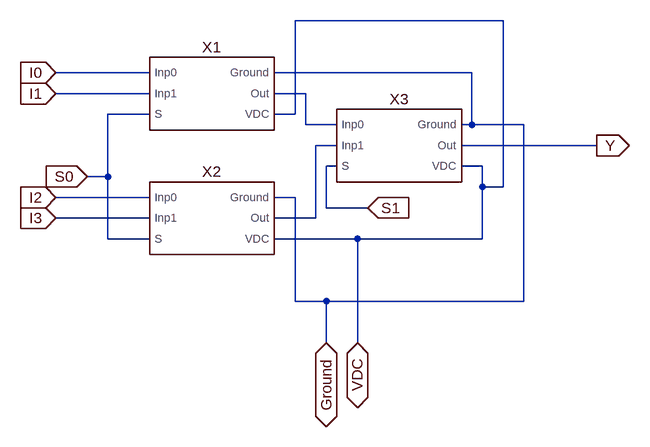
[diagram p0: schematic 4X1_MUX.asc]
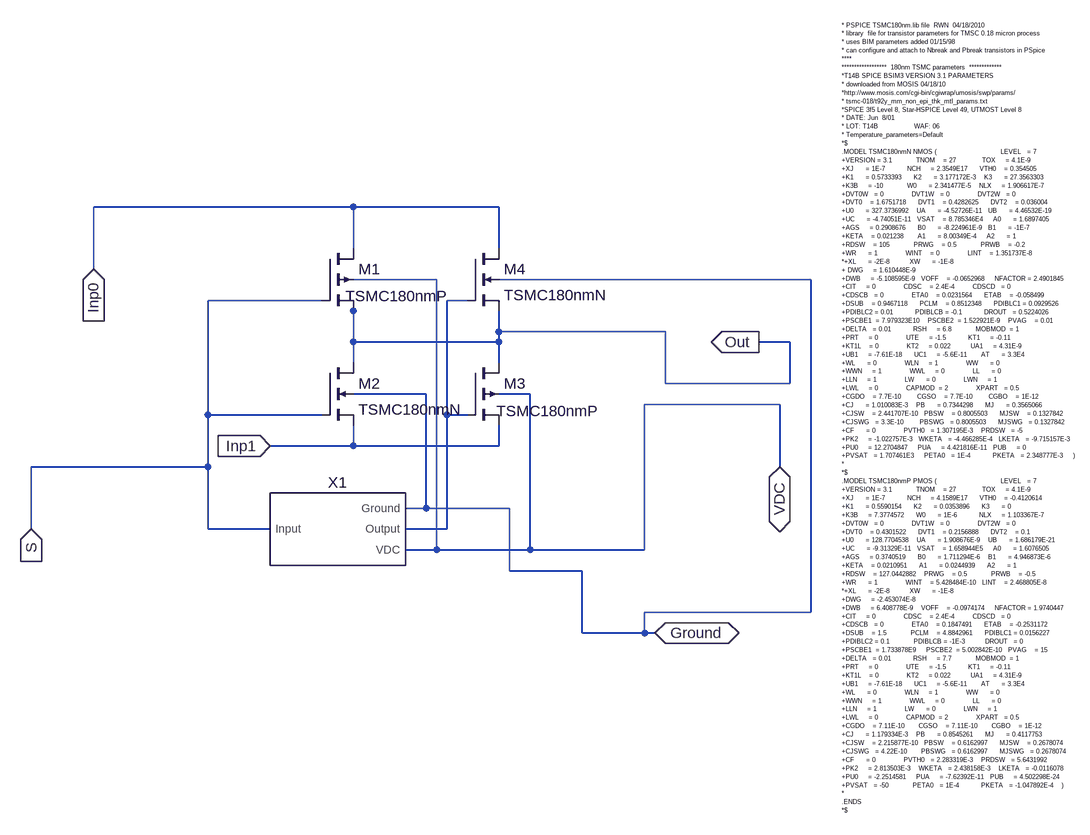
[diagram p1: sub-circuit 2x1_mux.asc]
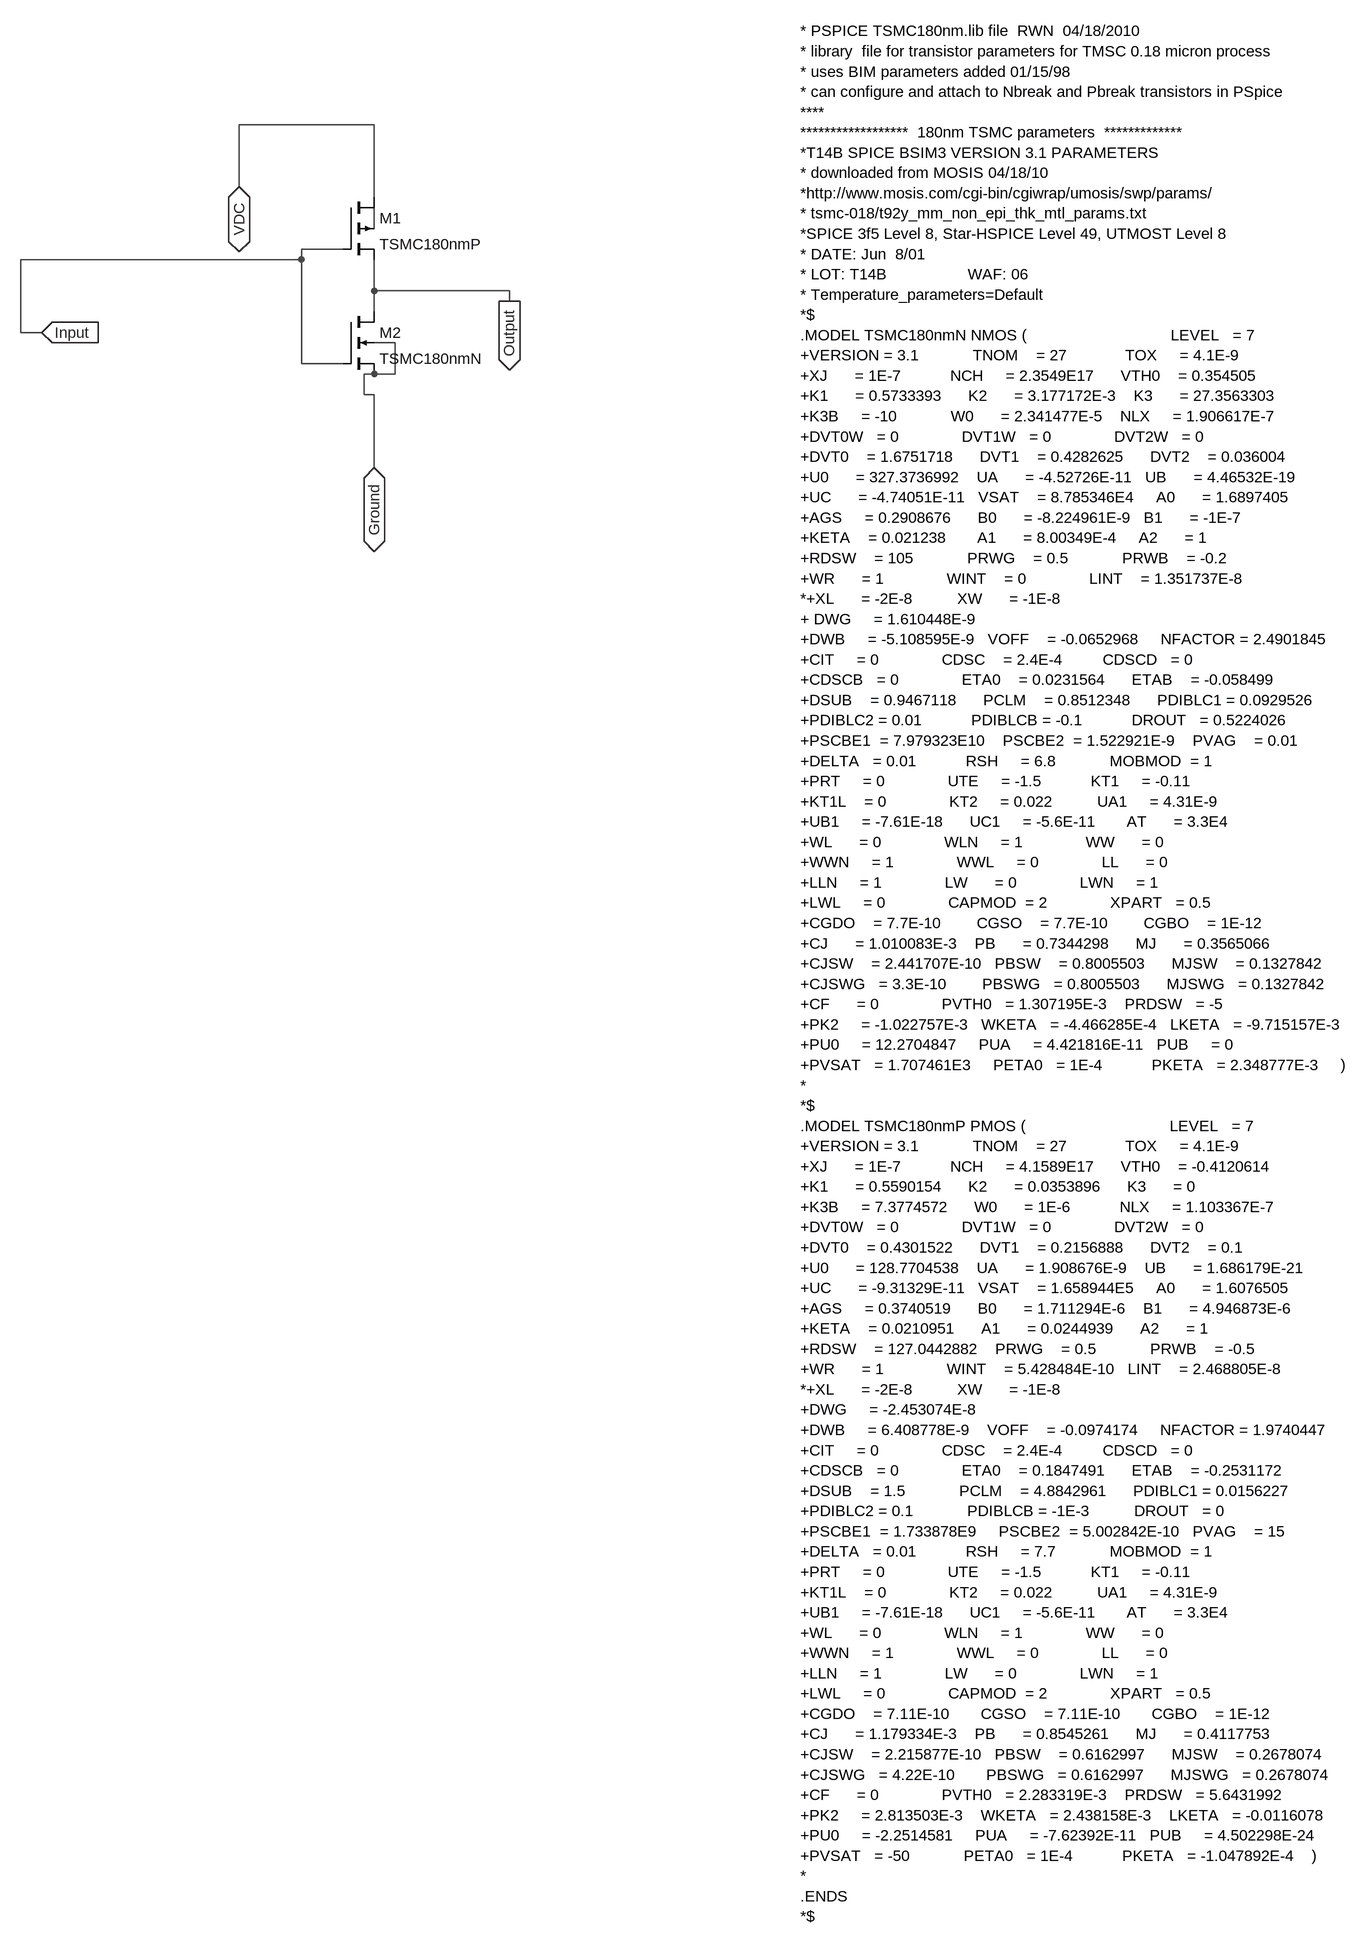
[diagram p2: sub-circuit not_gate.asc]
4X1_MUX.asc, the LTspice schematic file:
Version 4
SHEET 1 880 704
WIRE 656 64 336 64
WIRE 112 144 -32 144
WIRE 608 144 304 144
WIRE 112 176 -32 176
WIRE 352 176 304 176
WIRE 112 208 48 208
WIRE 336 208 336 64
WIRE 336 208 304 208
WIRE 352 224 352 176
WIRE 400 224 352 224
WIRE 608 224 608 144
WIRE 608 224 592 224
WIRE 688 224 608 224
WIRE 400 256 368 256
WIRE 800 256 592 256
WIRE 400 288 384 288
WIRE 624 288 592 288
WIRE 48 304 48 208
WIRE 48 304 16 304
WIRE 624 320 624 288
WIRE 656 320 656 64
WIRE 656 320 624 320
WIRE 112 336 -32 336
WIRE 336 336 304 336
WIRE 384 352 384 288
WIRE 448 352 384 352
WIRE 112 368 -32 368
WIRE 368 368 368 256
WIRE 368 368 304 368
WIRE 48 400 48 304
WIRE 112 400 48 400
WIRE 432 400 304 400
WIRE 624 400 624 320
WIRE 624 400 432 400
WIRE 336 496 336 336
WIRE 384 496 336 496
WIRE 688 496 688 224
WIRE 688 496 384 496
WIRE 384 560 384 496
WIRE 432 560 432 400
FLAG -32 144 I0
IOPIN -32 144 In
FLAG -32 176 I1
IOPIN -32 176 In
FLAG -32 336 I2
IOPIN -32 336 In
FLAG -32 368 I3
IOPIN -32 368 In
FLAG 16 304 S0
IOPIN 16 304 In
FLAG 448 352 S1
IOPIN 448 352 In
FLAG 432 560 VDC
IOPIN 432 560 BiDir
FLAG 384 560 Ground
IOPIN 384 560 BiDir
FLAG 800 256 Y
IOPIN 800 256 Out
SYMBOL 2X1_MUX 208 176 R0
SYMATTR InstName X1
SYMBOL 2X1_MUX 208 368 R0
SYMATTR InstName X2
SYMBOL 2X1_MUX 496 256 R0
SYMATTR InstName X3

2x1_mux.asc, the sub-circuit schematic file:
Version 4
SHEET 1 936 680
WIRE -192 -224 -592 -224
WIRE 32 -224 -192 -224
WIRE -192 -160 -192 -224
WIRE 32 -160 32 -224
WIRE -592 -128 -592 -224
WIRE -64 -112 -192 -112
WIRE 512 -112 32 -112
WIRE -240 -80 -416 -80
WIRE -16 -80 -48 -80
WIRE -192 -64 -192 -80
WIRE 32 -32 32 -64
WIRE 288 -32 32 -32
WIRE -192 -16 -192 -64
WIRE 32 -16 32 -32
WIRE 32 -16 -192 -16
WIRE 480 -16 432 -16
WIRE -192 16 -192 -16
WIRE 32 16 32 -16
WIRE 288 48 288 -32
WIRE 480 48 480 -16
WIRE 480 48 288 48
WIRE -80 64 -192 64
WIRE 80 64 32 64
WIRE 464 80 256 80
WIRE -416 96 -416 -80
WIRE -240 96 -416 96
WIRE -48 96 -48 -80
WIRE -16 96 -48 96
WIRE -192 144 -192 112
WIRE -192 144 -320 144
WIRE 32 144 32 112
WIRE 32 144 -192 144
WIRE -416 176 -416 96
WIRE -416 176 -688 176
WIRE 464 176 464 80
WIRE -80 240 -80 64
WIRE -80 240 -112 240
WIRE 48 240 -80 240
WIRE -688 272 -688 176
WIRE -416 272 -416 176
WIRE -320 272 -416 272
WIRE -48 272 -48 96
WIRE -48 272 -112 272
WIRE -64 304 -64 -112
WIRE -64 304 -112 304
WIRE 80 304 80 64
WIRE 80 304 -64 304
WIRE 256 304 256 80
WIRE 256 304 80 304
WIRE 48 336 48 240
WIRE 160 336 48 336
WIRE 512 400 512 -112
WIRE 512 400 256 400
WIRE 160 432 160 336
WIRE 256 432 256 400
WIRE 256 432 160 432
WIRE 272 432 256 432
FLAG -592 -128 Inp0
IOPIN -592 -128 In
FLAG -320 144 Inp1
IOPIN -320 144 In
FLAG -688 272 S
IOPIN -688 272 In
FLAG 464 176 VDC
IOPIN 464 176 BiDir
FLAG 272 432 Ground
IOPIN 272 432 BiDir
FLAG 432 -16 Out
IOPIN 432 -16 Out
SYMBOL pmos4 -240 -160 R0
WINDOW 3 36 73 Left 2
SYMATTR Value TSMC180nmP
SYMATTR InstName M1
SYMATTR Value2 l=180n w=720n
SYMBOL nmos4 -240 16 R0
SYMATTR InstName M2
SYMATTR Value TSMC180nmN
SYMATTR Value2 l=180n w=360n
SYMBOL pmos4 -16 16 R0
WINDOW 3 44 74 Left 2
SYMATTR Value TSMC180nmP
SYMATTR InstName M3
SYMATTR Value2 l=180n w=720n
SYMBOL nmos4 -16 -160 R0
SYMATTR InstName M4
SYMATTR Value TSMC180nmN
SYMATTR Value2 l=180n w=360n
SYMBOL NOT_Gate -224 272 R0
SYMATTR InstName X1
TEXT 560 -504 Left 0 !* PSPICE TSMC180nm.lib file  RWN  04/18/2010\n* library  file for transistor parameters for TMSC 0.18 micron process\n* uses BIM parameters added 01/15/98\n* can configure and attach to Nbreak and Pbreak transistors in PSpice\n****\n******************  180nm TSMC parameters  *************\n*T14B SPICE BSIM3 VERSION 3.1 PARAMETERS\n* downloaded from MOSIS 04/18/10\n*http://www.mosis.com/cgi-bin/cgiwrap/umosis/swp/params/\n* tsmc-018/t92y_mm_non_epi_thk_mtl_params.txt\n*SPICE 3f5 Level 8, Star-HSPICE Level 49, UTMOST Level 8\n* DATE: Jun  8/01\n* LOT: T14B                  WAF: 06\n* Temperature_parameters=Default\n*$\n.MODEL TSMC180nmN NMOS (                                LEVEL   = 7\n+VERSION = 3.1            TNOM    = 27             TOX     = 4.1E-9\n+XJ      = 1E-7           NCH     = 2.3549E17      VTH0    = 0.354505\n+K1      = 0.5733393      K2      = 3.177172E-3    K3      = 27.3563303\n+K3B     = -10            W0      = 2.341477E-5    NLX     = 1.906617E-7\n+DVT0W   = 0              DVT1W   = 0              DVT2W   = 0\n+DVT0    = 1.6751718      DVT1    = 0.4282625      DVT2    = 0.036004\n+U0      = 327.3736992    UA      = -4.52726E-11   UB      = 4.46532E-19\n+UC      = -4.74051E-11   VSAT    = 8.785346E4     A0      = 1.6897405\n+AGS     = 0.2908676      B0      = -8.224961E-9   B1      = -1E-7\n+KETA    = 0.021238       A1      = 8.00349E-4     A2      = 1\n+RDSW    = 105            PRWG    = 0.5            PRWB    = -0.2\n+WR      = 1              WINT    = 0              LINT    = 1.351737E-8\n*+XL      = -2E-8          XW      = -1E-8         \n+ DWG     = 1.610448E-9\n+DWB     = -5.108595E-9   VOFF    = -0.0652968     NFACTOR = 2.4901845\n+CIT     = 0              CDSC    = 2.4E-4         CDSCD   = 0\n+CDSCB   = 0              ETA0    = 0.0231564      ETAB    = -0.058499\n+DSUB    = 0.9467118      PCLM    = 0.8512348      PDIBLC1 = 0.0929526\n+PDIBLC2 = 0.01           PDIBLCB = -0.1           DROUT   = 0.5224026\n+PSCBE1  = 7.979323E10    PSCBE2  = 1.522921E-9    PVAG    = 0.01\n+DELTA   = 0.01           RSH     = 6.8            MOBMOD  = 1\n+PRT     = 0              UTE     = -1.5           KT1     = -0.11\n+KT1L    = 0              KT2     = 0.022          UA1     = 4.31E-9\n+UB1     = -7.61E-18      UC1     = -5.6E-11       AT      = 3.3E4\n+WL      = 0              WLN     = 1              WW      = 0\n+WWN     = 1              WWL     = 0              LL      = 0\n+LLN     = 1              LW      = 0              LWN     = 1\n+LWL     = 0              CAPMOD  = 2              XPART   = 0.5\n+CGDO    = 7.7E-10        CGSO    = 7.7E-10        CGBO    = 1E-12\n+CJ      = 1.010083E-3    PB      = 0.7344298      MJ      = 0.3565066\n+CJSW    = 2.441707E-10   PBSW    = 0.8005503      MJSW    = 0.1327842\n+CJSWG   = 3.3E-10        PBSWG   = 0.8005503      MJSWG   = 0.1327842\n+CF      = 0              PVTH0   = 1.307195E-3    PRDSW   = -5\n+PK2     = -1.022757E-3   WKETA   = -4.466285E-4   LKETA   = -9.715157E-3\n+PU0     = 12.2704847     PUA     = 4.421816E-11   PUB     = 0\n+PVSAT   = 1.707461E3     PETA0   = 1E-4           PKETA   = 2.348777E-3     )\n*\n*$\n.MODEL TSMC180nmP PMOS (                                LEVEL   = 7\n+VERSION = 3.1            TNOM    = 27             TOX     = 4.1E-9\n+XJ      = 1E-7           NCH     = 4.1589E17      VTH0    = -0.4120614\n+K1      = 0.5590154      K2      = 0.0353896      K3      = 0\n+K3B     = 7.3774572      W0      = 1E-6           NLX     = 1.103367E-7\n+DVT0W   = 0              DVT1W   = 0              DVT2W   = 0\n+DVT0    = 0.4301522      DVT1    = 0.2156888      DVT2    = 0.1\n+U0      = 128.7704538    UA      = 1.908676E-9    UB      = 1.686179E-21\n+UC      = -9.31329E-11   VSAT    = 1.658944E5     A0      = 1.6076505\n+AGS     = 0.3740519      B0      = 1.711294E-6    B1      = 4.946873E-6\n+KETA    = 0.0210951      A1      = 0.0244939      A2      = 1\n+RDSW    = 127.0442882    PRWG    = 0.5            PRWB    = -0.5\n+WR      = 1              WINT    = 5.428484E-10   LINT    = 2.468805E-8\n*+XL      = -2E-8          XW      = -1E-8          \n+DWG     = -2.453074E-8\n+DWB     = 6.408778E-9    VOFF    = -0.0974174     NFACTOR = 1.9740447\n+CIT     = 0              CDSC    = 2.4E-4         CDSCD   = 0\n+CDSCB   = 0              ETA0    = 0.1847491      ETAB    = -0.2531172\n+DSUB    = 1.5            PCLM    = 4.8842961      PDIBLC1 = 0.0156227\n+PDIBLC2 = 0.1            PDIBLCB = -1E-3          DROUT   = 0\n+PSCBE1  = 1.733878E9     PSCBE2  = 5.002842E-10   PVAG    = 15\n+DELTA   = 0.01           RSH     = 7.7            MOBMOD  = 1\n+PRT     = 0              UTE     = -1.5           KT1     = -0.11\n+KT1L    = 0              KT2     = 0.022          UA1     = 4.31E-9\n+UB1     = -7.61E-18      UC1     = -5.6E-11       AT      = 3.3E4\n+WL      = 0              WLN     = 1              WW      = 0\n+WWN     = 1              WWL     = 0              LL      = 0\n+LLN     = 1              LW      = 0              LWN     = 1\n+LWL     = 0              CAPMOD  = 2              XPART   = 0.5\n+CGDO    = 7.11E-10       CGSO    = 7.11E-10       CGBO    = 1E-12\n+CJ      = 1.179334E-3    PB      = 0.8545261      MJ      = 0.4117753\n+CJSW    = 2.215877E-10   PBSW    = 0.6162997      MJSW    = 0.2678074\n+CJSWG   = 4.22E-10       PBSWG   = 0.6162997      MJSWG   = 0.2678074\n+CF      = 0              PVTH0   = 2.283319E-3    PRDSW   = 5.6431992\n+PK2     = 2.813503E-3    WKETA   = 2.438158E-3    LKETA   = -0.0116078\n+PU0     = -2.2514581     PUA     = -7.62392E-11   PUB     = 4.502298E-24\n+PVSAT   = -50            PETA0   = 1E-4           PKETA   = -1.047892E-4    )\n*\n.ENDS    \n*$

not_gate.asc, the sub-circuit schematic file:
Version 4
SHEET 1 1352 1468
WIRE 320 -128 112 -128
WIRE 112 -32 112 -128
WIRE 320 -16 320 -128
WIRE 320 32 320 0
WIRE 272 64 208 64
WIRE 208 80 208 64
WIRE 208 80 -224 80
WIRE 320 128 320 80
WIRE 528 128 320 128
WIRE 528 144 528 128
WIRE 320 160 320 128
WIRE -224 192 -224 80
WIRE -192 192 -224 192
WIRE 352 208 320 208
WIRE 208 240 208 80
WIRE 272 240 208 240
WIRE 320 256 304 256
WIRE 352 256 352 208
WIRE 352 256 320 256
WIRE 304 288 304 256
WIRE 320 288 304 288
WIRE 320 400 320 288
FLAG 112 -32 VDC
IOPIN 112 -32 BiDir
FLAG 320 400 Ground
IOPIN 320 400 BiDir
FLAG -192 192 Input
IOPIN -192 192 In
FLAG 528 144 Output
IOPIN 528 144 Out
SYMBOL pmos4 272 -16 R0
SYMATTR InstName M1
SYMATTR Value TSMC180nmP
SYMATTR Value2 l=180n w=720n
SYMBOL nmos4 272 160 R0
SYMATTR InstName M2
SYMATTR Value TSMC180nmN
SYMATTR Value2 l=180n w=360n
TEXT 976 -272 Left 0 !* PSPICE TSMC180nm.lib file  RWN  04/18/2010\n* library  file for transistor parameters for TMSC 0.18 micron process\n* uses BIM parameters added 01/15/98\n* can configure and attach to Nbreak and Pbreak transistors in PSpice\n****\n******************  180nm TSMC parameters  *************\n*T14B SPICE BSIM3 VERSION 3.1 PARAMETERS\n* downloaded from MOSIS 04/18/10\n*http://www.mosis.com/cgi-bin/cgiwrap/umosis/swp/params/\n* tsmc-018/t92y_mm_non_epi_thk_mtl_params.txt\n*SPICE 3f5 Level 8, Star-HSPICE Level 49, UTMOST Level 8\n* DATE: Jun  8/01\n* LOT: T14B                  WAF: 06\n* Temperature_parameters=Default\n*$\n.MODEL TSMC180nmN NMOS (                                LEVEL   = 7\n+VERSION = 3.1            TNOM    = 27             TOX     = 4.1E-9\n+XJ      = 1E-7           NCH     = 2.3549E17      VTH0    = 0.354505\n+K1      = 0.5733393      K2      = 3.177172E-3    K3      = 27.3563303\n+K3B     = -10            W0      = 2.341477E-5    NLX     = 1.906617E-7\n+DVT0W   = 0              DVT1W   = 0              DVT2W   = 0\n+DVT0    = 1.6751718      DVT1    = 0.4282625      DVT2    = 0.036004\n+U0      = 327.3736992    UA      = -4.52726E-11   UB      = 4.46532E-19\n+UC      = -4.74051E-11   VSAT    = 8.785346E4     A0      = 1.6897405\n+AGS     = 0.2908676      B0      = -8.224961E-9   B1      = -1E-7\n+KETA    = 0.021238       A1      = 8.00349E-4     A2      = 1\n+RDSW    = 105            PRWG    = 0.5            PRWB    = -0.2\n+WR      = 1              WINT    = 0              LINT    = 1.351737E-8\n*+XL      = -2E-8          XW      = -1E-8         \n+ DWG     = 1.610448E-9\n+DWB     = -5.108595E-9   VOFF    = -0.0652968     NFACTOR = 2.4901845\n+CIT     = 0              CDSC    = 2.4E-4         CDSCD   = 0\n+CDSCB   = 0              ETA0    = 0.0231564      ETAB    = -0.058499\n+DSUB    = 0.9467118      PCLM    = 0.8512348      PDIBLC1 = 0.0929526\n+PDIBLC2 = 0.01           PDIBLCB = -0.1           DROUT   = 0.5224026\n+PSCBE1  = 7.979323E10    PSCBE2  = 1.522921E-9    PVAG    = 0.01\n+DELTA   = 0.01           RSH     = 6.8            MOBMOD  = 1\n+PRT     = 0              UTE     = -1.5           KT1     = -0.11\n+KT1L    = 0              KT2     = 0.022          UA1     = 4.31E-9\n+UB1     = -7.61E-18      UC1     = -5.6E-11       AT      = 3.3E4\n+WL      = 0              WLN     = 1              WW      = 0\n+WWN     = 1              WWL     = 0              LL      = 0\n+LLN     = 1              LW      = 0              LWN     = 1\n+LWL     = 0              CAPMOD  = 2              XPART   = 0.5\n+CGDO    = 7.7E-10        CGSO    = 7.7E-10        CGBO    = 1E-12\n+CJ      = 1.010083E-3    PB      = 0.7344298      MJ      = 0.3565066\n+CJSW    = 2.441707E-10   PBSW    = 0.8005503      MJSW    = 0.1327842\n+CJSWG   = 3.3E-10        PBSWG   = 0.8005503      MJSWG   = 0.1327842\n+CF      = 0              PVTH0   = 1.307195E-3    PRDSW   = -5\n+PK2     = -1.022757E-3   WKETA   = -4.466285E-4   LKETA   = -9.715157E-3\n+PU0     = 12.2704847     PUA     = 4.421816E-11   PUB     = 0\n+PVSAT   = 1.707461E3     PETA0   = 1E-4           PKETA   = 2.348777E-3     )\n*\n*$\n.MODEL TSMC180nmP PMOS (                                LEVEL   = 7\n+VERSION = 3.1            TNOM    = 27             TOX     = 4.1E-9\n+XJ      = 1E-7           NCH     = 4.1589E17      VTH0    = -0.4120614\n+K1      = 0.5590154      K2      = 0.0353896      K3      = 0\n+K3B     = 7.3774572      W0      = 1E-6           NLX     = 1.103367E-7\n+DVT0W   = 0              DVT1W   = 0              DVT2W   = 0\n+DVT0    = 0.4301522      DVT1    = 0.2156888      DVT2    = 0.1\n+U0      = 128.7704538    UA      = 1.908676E-9    UB      = 1.686179E-21\n+UC      = -9.31329E-11   VSAT    = 1.658944E5     A0      = 1.6076505\n+AGS     = 0.3740519      B0      = 1.711294E-6    B1      = 4.946873E-6\n+KETA    = 0.0210951      A1      = 0.0244939      A2      = 1\n+RDSW    = 127.0442882    PRWG    = 0.5            PRWB    = -0.5\n+WR      = 1              WINT    = 5.428484E-10   LINT    = 2.468805E-8\n*+XL      = -2E-8          XW      = -1E-8          \n+DWG     = -2.453074E-8\n+DWB     = 6.408778E-9    VOFF    = -0.0974174     NFACTOR = 1.9740447\n+CIT     = 0              CDSC    = 2.4E-4         CDSCD   = 0\n+CDSCB   = 0              ETA0    = 0.1847491      ETAB    = -0.2531172\n+DSUB    = 1.5            PCLM    = 4.8842961      PDIBLC1 = 0.0156227\n+PDIBLC2 = 0.1            PDIBLCB = -1E-3          DROUT   = 0\n+PSCBE1  = 1.733878E9     PSCBE2  = 5.002842E-10   PVAG    = 15\n+DELTA   = 0.01           RSH     = 7.7            MOBMOD  = 1\n+PRT     = 0              UTE     = -1.5           KT1     = -0.11\n+KT1L    = 0              KT2     = 0.022          UA1     = 4.31E-9\n+UB1     = -7.61E-18      UC1     = -5.6E-11       AT      = 3.3E4\n+WL      = 0              WLN     = 1              WW      = 0\n+WWN     = 1              WWL     = 0              LL      = 0\n+LLN     = 1              LW      = 0              LWN     = 1\n+LWL     = 0              CAPMOD  = 2              XPART   = 0.5\n+CGDO    = 7.11E-10       CGSO    = 7.11E-10       CGBO    = 1E-12\n+CJ      = 1.179334E-3    PB      = 0.8545261      MJ      = 0.4117753\n+CJSW    = 2.215877E-10   PBSW    = 0.6162997      MJSW    = 0.2678074\n+CJSWG   = 4.22E-10       PBSWG   = 0.6162997      MJSWG   = 0.2678074\n+CF      = 0              PVTH0   = 2.283319E-3    PRDSW   = 5.6431992\n+PK2     = 2.813503E-3    WKETA   = 2.438158E-3    LKETA   = -0.0116078\n+PU0     = -2.2514581     PUA     = -7.62392E-11   PUB     = 4.502298E-24\n+PVSAT   = -50            PETA0   = 1E-4           PKETA   = -1.047892E-4    )\n*\n.ENDS    \n*$

The netlist it stands for:
* 4X1_MUX.asc
XX1 I0 I1 S0 Ground N001 VDC 2x1_mux
XX2 I2 I3 S0 Ground N002 VDC 2x1_mux
XX3 N001 N002 S1 Ground Y VDC 2x1_mux

* block symbol definitions
.subckt 2x1_mux Inp0 Inp1 S Ground Out VDC
M1 Inp0 S Out VDC TSMC180nmP l=180n w=720n
M2 Out S Inp1 Ground TSMC180nmN l=180n w=360n
M3 Out N001 Inp1 VDC TSMC180nmP l=180n w=720n
M4 Inp0 N001 Out Ground TSMC180nmN l=180n w=360n
XX1 S Ground N001 VDC not_gate
* PSPICE TSMC180nm.lib file  RWN  04/18/2010
* library  file for transistor parameters for TMSC 0.18 micron process
* uses BIM parameters added 01/15/98
* can configure and attach to Nbreak and Pbreak transistors in PSpice
****
******************  180nm TSMC parameters  *************
*T14B SPICE BSIM3 VERSION 3.1 PARAMETERS
* downloaded from MOSIS 04/18/10
*http://www.mosis.com/cgi-bin/cgiwrap/umosis/swp/params/
* tsmc-018/t92y_mm_non_epi_thk_mtl_params.txt
*SPICE 3f5 Level 8, Star-HSPICE Level 49, UTMOST Level 8
* DATE: Jun  8/01
* LOT: T14B                  WAF: 06
* Temperature_parameters=Default
*$
.MODEL TSMC180nmN NMOS (                                LEVEL   = 7
+VERSION = 3.1            TNOM    = 27             TOX     = 4.1E-9
+XJ      = 1E-7           NCH     = 2.3549E17      VTH0    = 0.354505
+K1      = 0.5733393      K2      = 3.177172E-3    K3      = 27.3563303
+K3B     = -10            W0      = 2.341477E-5    NLX     = 1.906617E-7
+DVT0W   = 0              DVT1W   = 0              DVT2W   = 0
+DVT0    = 1.6751718      DVT1    = 0.4282625      DVT2    = 0.036004
+U0      = 327.3736992    UA      = -4.52726E-11   UB      = 4.46532E-19
+UC      = -4.74051E-11   VSAT    = 8.785346E4     A0      = 1.6897405
+AGS     = 0.2908676      B0      = -8.224961E-9   B1      = -1E-7
+KETA    = 0.021238       A1      = 8.00349E-4     A2      = 1
+RDSW    = 105            PRWG    = 0.5            PRWB    = -0.2
+WR      = 1              WINT    = 0              LINT    = 1.351737E-8
*+XL      = -2E-8          XW      = -1E-8
+ DWG     = 1.610448E-9
+DWB     = -5.108595E-9   VOFF    = -0.0652968     NFACTOR = 2.4901845
+CIT     = 0              CDSC    = 2.4E-4         CDSCD   = 0
+CDSCB   = 0              ETA0    = 0.0231564      ETAB    = -0.058499
+DSUB    = 0.9467118      PCLM    = 0.8512348      PDIBLC1 = 0.0929526
+PDIBLC2 = 0.01           PDIBLCB = -0.1           DROUT   = 0.5224026
+PSCBE1  = 7.979323E10    PSCBE2  = 1.522921E-9    PVAG    = 0.01
+DELTA   = 0.01           RSH     = 6.8            MOBMOD  = 1
+PRT     = 0              UTE     = -1.5           KT1     = -0.11
+KT1L    = 0              KT2     = 0.022          UA1     = 4.31E-9
+UB1     = -7.61E-18      UC1     = -5.6E-11       AT      = 3.3E4
+WL      = 0              WLN     = 1              WW      = 0
+WWN     = 1              WWL     = 0              LL      = 0
+LLN     = 1              LW      = 0              LWN     = 1
+LWL     = 0              CAPMOD  = 2              XPART   = 0.5
+CGDO    = 7.7E-10        CGSO    = 7.7E-10        CGBO    = 1E-12
+CJ      = 1.010083E-3    PB      = 0.7344298      MJ      = 0.3565066
+CJSW    = 2.441707E-10   PBSW    = 0.8005503      MJSW    = 0.1327842
+CJSWG   = 3.3E-10        PBSWG   = 0.8005503      MJSWG   = 0.1327842
+CF      = 0              PVTH0   = 1.307195E-3    PRDSW   = -5
+PK2     = -1.022757E-3   WKETA   = -4.466285E-4   LKETA   = -9.715157E-3
+PU0     = 12.2704847     PUA     = 4.421816E-11   PUB     = 0
+PVSAT   = 1.707461E3     PETA0   = 1E-4           PKETA   = 2.348777E-3     )
*
*$
.MODEL TSMC180nmP PMOS (                                LEVEL   = 7
+VERSION = 3.1            TNOM    = 27             TOX     = 4.1E-9
+XJ      = 1E-7           NCH     = 4.1589E17      VTH0    = -0.4120614
+K1      = 0.5590154      K2      = 0.0353896      K3      = 0
+K3B     = 7.3774572      W0      = 1E-6           NLX     = 1.103367E-7
+DVT0W   = 0              DVT1W   = 0              DVT2W   = 0
+DVT0    = 0.4301522      DVT1    = 0.2156888      DVT2    = 0.1
+U0      = 128.7704538    UA      = 1.908676E-9    UB      = 1.686179E-21
+UC      = -9.31329E-11   VSAT    = 1.658944E5     A0      = 1.6076505
+AGS     = 0.3740519      B0      = 1.711294E-6    B1      = 4.946873E-6
+KETA    = 0.0210951      A1      = 0.0244939      A2      = 1
+RDSW    = 127.0442882    PRWG    = 0.5            PRWB    = -0.5
+WR      = 1              WINT    = 5.428484E-10   LINT    = 2.468805E-8
*+XL      = -2E-8          XW      = -1E-8
+DWG     = -2.453074E-8
+DWB     = 6.408778E-9    VOFF    = -0.0974174     NFACTOR = 1.9740447
+CIT     = 0              CDSC    = 2.4E-4         CDSCD   = 0
+CDSCB   = 0              ETA0    = 0.1847491      ETAB    = -0.2531172
+DSUB    = 1.5            PCLM    = 4.8842961      PDIBLC1 = 0.0156227
+PDIBLC2 = 0.1            PDIBLCB = -1E-3          DROUT   = 0
+PSCBE1  = 1.733878E9     PSCBE2  = 5.002842E-10   PVAG    = 15
+DELTA   = 0.01           RSH     = 7.7            MOBMOD  = 1
+PRT     = 0              UTE     = -1.5           KT1     = -0.11
+KT1L    = 0              KT2     = 0.022          UA1     = 4.31E-9
+UB1     = -7.61E-18      UC1     = -5.6E-11       AT      = 3.3E4
+WL      = 0              WLN     = 1              WW      = 0
+WWN     = 1              WWL     = 0              LL      = 0
+LLN     = 1              LW      = 0              LWN     = 1
+LWL     = 0              CAPMOD  = 2              XPART   = 0.5
+CGDO    = 7.11E-10       CGSO    = 7.11E-10       CGBO    = 1E-12
+CJ      = 1.179334E-3    PB      = 0.8545261      MJ      = 0.4117753
+CJSW    = 2.215877E-10   PBSW    = 0.6162997      MJSW    = 0.2678074
+CJSWG   = 4.22E-10       PBSWG   = 0.6162997      MJSWG   = 0.2678074
+CF      = 0              PVTH0   = 2.283319E-3    PRDSW   = 5.6431992
+PK2     = 2.813503E-3    WKETA   = 2.438158E-3    LKETA   = -0.0116078
+PU0     = -2.2514581     PUA     = -7.62392E-11   PUB     = 4.502298E-24
+PVSAT   = -50            PETA0   = 1E-4           PKETA   = -1.047892E-4    )
*
.ENDS
*$
.ends 2x1_mux

.subckt not_gate Input Ground Output VDC
M1 VDC Input Output N001 TSMC180nmP l=180n w=720n
M2 Output Input Ground Ground TSMC180nmN l=180n w=360n
* PSPICE TSMC180nm.lib file  RWN  04/18/2010
* library  file for transistor parameters for TMSC 0.18 micron process
* uses BIM parameters added 01/15/98
* can configure and attach to Nbreak and Pbreak transistors in PSpice
****
******************  180nm TSMC parameters  *************
*T14B SPICE BSIM3 VERSION 3.1 PARAMETERS
* downloaded from MOSIS 04/18/10
*http://www.mosis.com/cgi-bin/cgiwrap/umosis/swp/params/
* tsmc-018/t92y_mm_non_epi_thk_mtl_params.txt
*SPICE 3f5 Level 8, Star-HSPICE Level 49, UTMOST Level 8
* DATE: Jun  8/01
* LOT: T14B                  WAF: 06
* Temperature_parameters=Default
*$
.MODEL TSMC180nmN NMOS (                                LEVEL   = 7
+VERSION = 3.1            TNOM    = 27             TOX     = 4.1E-9
+XJ      = 1E-7           NCH     = 2.3549E17      VTH0    = 0.354505
+K1      = 0.5733393      K2      = 3.177172E-3    K3      = 27.3563303
+K3B     = -10            W0      = 2.341477E-5    NLX     = 1.906617E-7
+DVT0W   = 0              DVT1W   = 0              DVT2W   = 0
+DVT0    = 1.6751718      DVT1    = 0.4282625      DVT2    = 0.036004
+U0      = 327.3736992    UA      = -4.52726E-11   UB      = 4.46532E-19
+UC      = -4.74051E-11   VSAT    = 8.785346E4     A0      = 1.6897405
+AGS     = 0.2908676      B0      = -8.224961E-9   B1      = -1E-7
+KETA    = 0.021238       A1      = 8.00349E-4     A2      = 1
+RDSW    = 105            PRWG    = 0.5            PRWB    = -0.2
+WR      = 1              WINT    = 0              LINT    = 1.351737E-8
*+XL      = -2E-8          XW      = -1E-8
+ DWG     = 1.610448E-9
+DWB     = -5.108595E-9   VOFF    = -0.0652968     NFACTOR = 2.4901845
+CIT     = 0              CDSC    = 2.4E-4         CDSCD   = 0
+CDSCB   = 0              ETA0    = 0.0231564      ETAB    = -0.058499
+DSUB    = 0.9467118      PCLM    = 0.8512348      PDIBLC1 = 0.0929526
+PDIBLC2 = 0.01           PDIBLCB = -0.1           DROUT   = 0.5224026
+PSCBE1  = 7.979323E10    PSCBE2  = 1.522921E-9    PVAG    = 0.01
+DELTA   = 0.01           RSH     = 6.8            MOBMOD  = 1
+PRT     = 0              UTE     = -1.5           KT1     = -0.11
+KT1L    = 0              KT2     = 0.022          UA1     = 4.31E-9
+UB1     = -7.61E-18      UC1     = -5.6E-11       AT      = 3.3E4
+WL      = 0              WLN     = 1              WW      = 0
+WWN     = 1              WWL     = 0              LL      = 0
+LLN     = 1              LW      = 0              LWN     = 1
+LWL     = 0              CAPMOD  = 2              XPART   = 0.5
+CGDO    = 7.7E-10        CGSO    = 7.7E-10        CGBO    = 1E-12
+CJ      = 1.010083E-3    PB      = 0.7344298      MJ      = 0.3565066
+CJSW    = 2.441707E-10   PBSW    = 0.8005503      MJSW    = 0.1327842
+CJSWG   = 3.3E-10        PBSWG   = 0.8005503      MJSWG   = 0.1327842
+CF      = 0              PVTH0   = 1.307195E-3    PRDSW   = -5
+PK2     = -1.022757E-3   WKETA   = -4.466285E-4   LKETA   = -9.715157E-3
+PU0     = 12.2704847     PUA     = 4.421816E-11   PUB     = 0
+PVSAT   = 1.707461E3     PETA0   = 1E-4           PKETA   = 2.348777E-3     )
*
*$
.MODEL TSMC180nmP PMOS (                                LEVEL   = 7
+VERSION = 3.1            TNOM    = 27             TOX     = 4.1E-9
+XJ      = 1E-7           NCH     = 4.1589E17      VTH0    = -0.4120614
+K1      = 0.5590154      K2      = 0.0353896      K3      = 0
+K3B     = 7.3774572      W0      = 1E-6           NLX     = 1.103367E-7
+DVT0W   = 0              DVT1W   = 0              DVT2W   = 0
+DVT0    = 0.4301522      DVT1    = 0.2156888      DVT2    = 0.1
+U0      = 128.7704538    UA      = 1.908676E-9    UB      = 1.686179E-21
+UC      = -9.31329E-11   VSAT    = 1.658944E5     A0      = 1.6076505
+AGS     = 0.3740519      B0      = 1.711294E-6    B1      = 4.946873E-6
+KETA    = 0.0210951      A1      = 0.0244939      A2      = 1
+RDSW    = 127.0442882    PRWG    = 0.5            PRWB    = -0.5
+WR      = 1              WINT    = 5.428484E-10   LINT    = 2.468805E-8
*+XL      = -2E-8          XW      = -1E-8
+DWG     = -2.453074E-8
+DWB     = 6.408778E-9    VOFF    = -0.0974174     NFACTOR = 1.9740447
+CIT     = 0              CDSC    = 2.4E-4         CDSCD   = 0
+CDSCB   = 0              ETA0    = 0.1847491      ETAB    = -0.2531172
+DSUB    = 1.5            PCLM    = 4.8842961      PDIBLC1 = 0.0156227
+PDIBLC2 = 0.1            PDIBLCB = -1E-3          DROUT   = 0
+PSCBE1  = 1.733878E9     PSCBE2  = 5.002842E-10   PVAG    = 15
+DELTA   = 0.01           RSH     = 7.7            MOBMOD  = 1
+PRT     = 0              UTE     = -1.5           KT1     = -0.11
+KT1L    = 0              KT2     = 0.022          UA1     = 4.31E-9
+UB1     = -7.61E-18      UC1     = -5.6E-11       AT      = 3.3E4
+WL      = 0              WLN     = 1              WW      = 0
+WWN     = 1              WWL     = 0              LL      = 0
+LLN     = 1              LW      = 0              LWN     = 1
+LWL     = 0              CAPMOD  = 2              XPART   = 0.5
+CGDO    = 7.11E-10       CGSO    = 7.11E-10       CGBO    = 1E-12
+CJ      = 1.179334E-3    PB      = 0.8545261      MJ      = 0.4117753
+CJSW    = 2.215877E-10   PBSW    = 0.6162997      MJSW    = 0.2678074
+CJSWG   = 4.22E-10       PBSWG   = 0.6162997      MJSWG   = 0.2678074
+CF      = 0              PVTH0   = 2.283319E-3    PRDSW   = 5.6431992
+PK2     = 2.813503E-3    WKETA   = 2.438158E-3    LKETA   = -0.0116078
+PU0     = -2.2514581     PUA     = -7.62392E-11   PUB     = 4.502298E-24
+PVSAT   = -50            PETA0   = 1E-4           PKETA   = -1.047892E-4    )
*
.ENDS
*$
.ends not_gate

.model NMOS NMOS
.model PMOS PMOS
.lib standard.mos
.backanno
.end